# Altium project main_board.PrjPcb
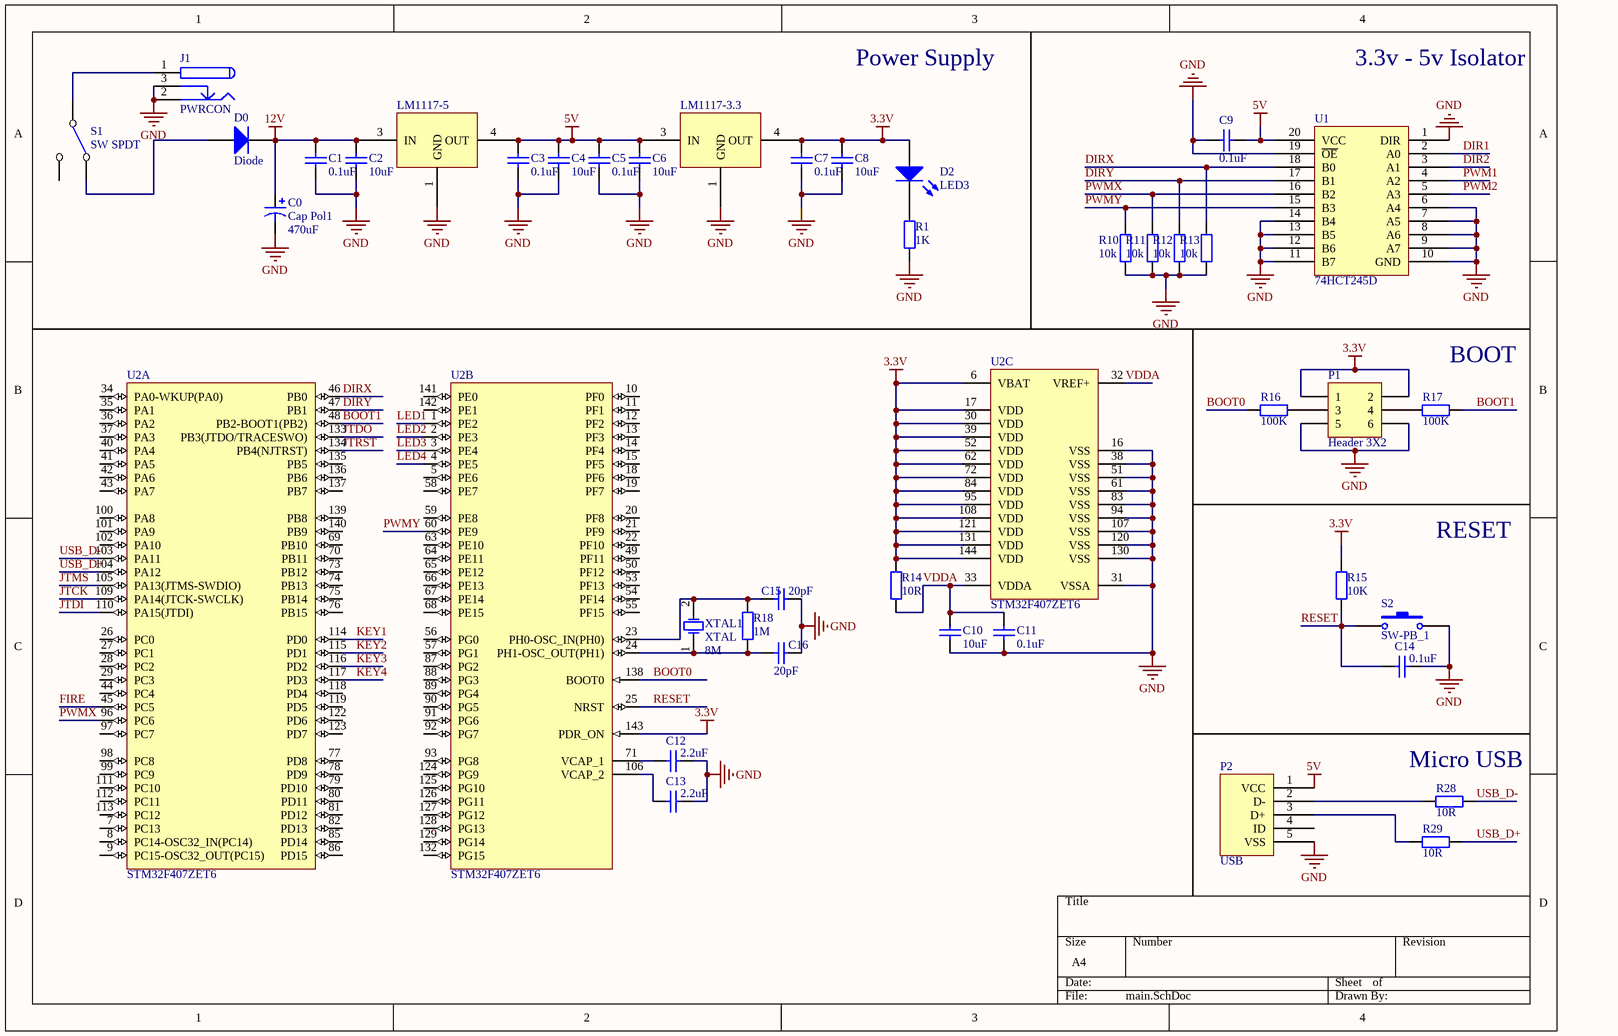
[diagram p0: main.SchDoc]
2 sheets, 61 parts. Net scope: global (net labels, ports and power ports of the same name join across sheets).
Board file: main_board.PcbDoc
Sheets:
  main.SchDoc
  other.SchDoc

## Sheet main.SchDoc
size A4

### Parts
C0  Cap Pol1  value 470uF  [CAP-10]
C1  value 0.1uF  [C-0603]  (hidden comment: Cap)
C2  value 10uF  [C-0603]  (hidden comment: Cap)
C3  value 0.1uF  [C-0603]  (hidden comment: Cap)
C4  value 10uF  [C-0603]  (hidden comment: Cap)
C5  value 0.1uF  [C-0603]  (hidden comment: Cap)
C6  value 10uF  [C-0603]  (hidden comment: Cap)
C7  value 0.1uF  [C-0603]  (hidden comment: Cap)
C8  value 10uF  [C-0603]  (hidden comment: Cap)
C9  value 0.1uF  [C-0603]  (hidden comment: Cap)
C10  value 10uF  [C-0603]  (hidden comment: Cap)
C11  value 0.1uF  [C-0603]  (hidden comment: Cap)
C12  value 2.2uF  [C-0603]  (hidden comment: Cap)
C13  value 2.2uF  [C-0603]  (hidden comment: Cap)
C14  value 0.1uF  [C-0603]  (hidden comment: Cap)
C15  value 20pF  [C-0603]  (hidden comment: Cap)
C16  value 20pF  [C-0603]  (hidden comment: Cap)
D0  Diode  [DIODE-SMA/SMB]
D2  LED3  [DIODE-1206]
J1  PWRCON  [DC-005A]
LM1117-3.3  LM1117  [lm1117]  (value not drawn)
LM1117-5  LM1117  [lm1117]  (value not drawn)
P1  Header 3X2  [HDR2X3]
P2  USB  [USB_MINI]
R1  value 1K  [R-0603]  (hidden comment: Res2)
R10  value 10k  [R-0603]  (hidden comment: Res2)
R11  value 10k  [R-0603]  (hidden comment: Res2)
R12  value 10k  [R-0603]  (hidden comment: Res2)
R13  value 10k  [R-0603]  (hidden comment: Res2)
R14  value 10R  [R-0603]  (hidden comment: Res2)
R15  value 10K  [R-0603]  (hidden comment: Res2)
R16  value 100K  [R-0603]  (hidden comment: Res2)
R17  value 100K  [R-0603]  (hidden comment: Res2)
R18  value 1M  [R-0603]  (hidden comment: Res2)
R28  value 10R  [R-0603]  (hidden comment: Res2)
R29  value 10R  [R-0603]  (hidden comment: Res2)
S1  SW SPDT  [SW3P]
S2  SW-PB_1  [SW-2-6*3]
U1  74HCT245D  [TSSOP20]
U2  STM32F407ZET6  [STM-LQFP144_M]  (parts A,B,C of 3)
XTAL1  XTAL  Frequence: 8M  [XTAL-QC49/SMD]

### Nets
3.3V: C7.2 C8.2 D2.1(A) LM1117-3.3.4(OUT) P1.1 P1.2 R14.2 R15.2 U2.6(VBAT) U2.17(VDD) U2.30(VDD) U2.39(VDD) U2.52(VDD) U2.62(VDD) U2.72(VDD) U2.84(VDD) U2.95(VDD) U2.108(VDD) U2.121(VDD) U2.131(VDD) U2.143(PDR_ON) U2.144(VDD)
5V: C3.2 C4.2 C5.2 C6.2 C9.1 LM1117-3.3.3(IN) LM1117-5.4(OUT) P2.1(VCC) U1.20(VCC)
12V: C0.1 C1.2 C2.2 D0.2(K) LM1117-5.3(IN)
GND: C0.2 C1.1 C2.1 C3.1 C4.1 C5.1 C6.1 C7.1 C8.1 C9.2 C10.1 C11.1 C12.1 C13.1 C14.1 C15.2 C16.2 J1.2 J1.3 LM1117-3.3.1(GND) LM1117-5.1(GND) P1.5 P1.6 P2.5(VSS) R1.1 R10.2 R11.2 R12.2 R13.2 S2.2 U1.1(DIR) U1.6(A4) U1.7(A5) U1.8(A6) U1.9(A7) U1.10(GND) U1.11(B7) U1.12(B6) U1.13(B5) U1.14(B4) U1.19(~{OE}) U2.16(VSS) U2.31(VSSA) U2.38(VSS) U2.51(VSS) U2.61(VSS) U2.83(VSS) U2.94(VSS) U2.107(VSS) U2.120(VSS) U2.130(VSS)
BOOT0: R16.2 U2.138(BOOT0)
BOOT1: R17.1 U2.48(PB2-BOOT1(PB2))
DIR1: U1.2(A0)
DIR2: U1.3(A1)
DIRX: R13.1 U1.18(B0) U2.46(PB0)
DIRY: R12.1 U1.17(B1) U2.47(PB1)
FIRE: U2.45(PC5)
JTCK: U2.109(PA14(JTCK-SWCLK))
JTDI: U2.110(PA15(JTDI))
JTDO: U2.133(PB3(JTDO/TRACESWO))
JTMS: U2.105(PA13(JTMS-SWDIO))
JTRST: U2.134(PB4(NJTRST))
KEY1: U2.114(PD0)
KEY2: U2.115(PD1)
KEY3: U2.116(PD2)
KEY4: U2.117(PD3)
LED1: U2.1(PE2)
LED2: U2.2(PE3)
LED3: U2.3(PE4)
LED4: U2.4(PE5)
PWM1: U1.4(A2)
PWM2: U1.5(A3)
PWMX: R11.1 U1.16(B2) U2.96(PC6)
PWMY: R10.1 U1.15(B3) U2.60(PE9)
RESET: C14.2 R15.1 S2.1 U2.25(NRST)
USB_D+: R29.1 U2.104(PA12)
USB_D-: R28.1 U2.103(PA11)
VDDA: C10.2 C11.2 R14.1 U2.32(VREF+) U2.33(VDDA)
NetC12_2: C12.2 U2.71(VCAP_1)
NetC13_2: C13.2 U2.106(VCAP_2)
NetC15_1: C15.1 R18.2 U2.23(PH0-OSC_IN(PH0)) XTAL1.2
NetC16_1: C16.1 R18.1 U2.24(PH1-OSC_OUT(PH1)) XTAL1.1
NetD0_1: D0.1(A) S1.2(NC)
NetD2_2: D2.2(K) R1.2
NetJ1_1: J1.1 S1.1(COMMON)
NetP1_3: P1.3 R16.1
NetP1_4: P1.4 R17.2
NetP2_2: P2.2(D-) R28.2
NetP2_3: P2.3(D+) R29.2

Not connected (* = marked no-connect by the designer): P2 4(ID); S1 3(NO); U2 5(PE6) 7(PC13) 8(PC14-OSC32_IN(PC14)) 9(PC15-OSC32_OUT(PC15)) 10(PF0) 11(PF1) 12(PF2) 13(PF3) 14(PF4) 15(PF5) 18(PF6) 19(PF7) 20(PF8) 21(PF9) 22(PF10) 26(PC0) 27(PC1) 28(PC2) 29(PC3) 34(PA0-WKUP(PA0)) 35(PA1) 36(PA2) 37(PA3) 40(PA4) 41(PA5) 42(PA6) 43(PA7) 44(PC4) 49(PF11) 50(PF12) 53(PF13) 54(PF14) 55(PF15) 56(PG0) 57(PG1) 58(PE7) 59(PE8) 63(PE10) 64(PE11) 65(PE12) 66(PE13) 67(PE14) 68(PE15) 69(PB10) 70(PB11) 73(PB12) 74(PB13) 75(PB14) 76(PB15) 77(PD8) 78(PD9) 79(PD10) 80(PD11) 81(PD12) 82(PD13) 85(PD14) 86(PD15) 87(PG2) 88(PG3) 89(PG4) 90(PG5) 91(PG6) 92(PG7) 93(PG8) 97(PC7) 98(PC8) 99(PC9) 100(PA8) 101(PA9) 102(PA10) 111(PC10) 112(PC11) 113(PC12) 118(PD4) 119(PD5) 122(PD6) 123(PD7) 124(PG9) 125(PG10) 126(PG11) 127(PG12) 128(PG13) 129(PG14) 132(PG15) 135(PB5) 136(PB6) 137(PB7) 139(PB8) 140(PB9) 141(PE0) 142(PE1)

### Notes on the sheet
- Power Supply
- 3.3v - 5v Isolator
- (near R17) BOOT
- RESET
- (near R28) Micro USB

### Library data of the parts
C0 = Cap Pol1: Polarized Capacitor (Radial); Published: 8-Jun-2000; LatestRevisionDate: 17-Jul-2002; LatestRevisionNote: Re-released for DXP Platform.; PackageReference: RB7.6-15; Publisher: Altium Limited; PackageDescription: Polarized Capacitor (Radial); 2 Leads
C1-C16 = Cap Semi: Capacitor (Semiconductor SIM Model); Published: 8-Jun-2000; LatestRevisionDate: 29-May-2009; LatestRevisionNote: IPC-7351 Footprint Added.; PackageReference: C1206; Publisher: Altium Limited; PackageDescription: Chip Capacitor
D0 = Diode: Default Diode; Published: 8-Jun-2000; LatestRevisionDate: 17-Jul-2002; LatestRevisionNote: Re-released for DXP Platform.; PackageVersion: Sep-1996; PackageReference: SMC; Publisher: Altium Limited; PackageDescription: DO-214-AB/SMC; 2 C-Bend Leads; Body 7.9 x 5.9 mm, inc. leads (LxW); Code_JEDEC: DO-214-AB
D2 = LED3: Typical BLUE SiC LED; Published: 8-Jun-2000; LatestRevisionDate: 17-Dec-2003; LatestRevisionNote: PCB Footprint replaced.; DatasheetVersion: 16-Apr-2002; PackageVersion: 16-Apr-2002; PackageReference: 3.5X2.8X1.9; Publisher: Altium Limited
J1 = PWRCON: 直流电源端子; Published: 17-Dec-2003; DatasheetDocument: 09-May-2002; Publisher: Altium Limited; ComponentLink1Description: Manufacturer Link; ComponentLink1URL: http://domino.kycon.com/internet/Products.html
P1 = Header 3X2: Header, 3-Pin, Dual row; LatestRevisionDate: 17-Jul-2002; LatestRevisionNote: Re-released for DXP Platform.; Publisher: Altium Limited
R1 R10-R18 R28 R29 = Res2: Resistor; Published: 8-Jun-2000; LatestRevisionDate: 17-Jul-2002; LatestRevisionNote: Re-released for DXP Platform.; PackageReference: AXIAL-0.4; Publisher: Altium Limited; PackageDescription: Axial Device, Thru-Hole; 2 Leads; 0.4 in Pin Spacing
S2 = SW-PB_1: Switch; Published: 24-Mar-1999; LatestRevisionDate: 17-Jul-2002; LatestRevisionNote: Re-released for DXP Platform.; PackageReference: SPST-2; Publisher: Altium Limited
U1 = 74lvc245
U2 = STM32F407ZET6: ARM Cortex-M4 32-bit MCU+FPU, 210 DMIPS, 512 kB Flash, 192 kB Internal RAM, 114 I/Os, 144-pin LQFP, -40 to 85 degC, Tray; Manufacturer: STMicroelectronics; D/A Converter: 2x12-bit; FLASH Size (Prog) (kB): 512; I/Os (High Current): 114; Internal RAM Size (kB): 192; Operating Frequency(F) (Processor speed) (MHz): 168; Supply Voltage(Vcc) max (V): 3.6; Supply Voltage(Vcc) min (V): 1.8; DatasheetVersion: Rev. 4; PackageVersion: Rev. 4, 06/2013; PackageReference: LQFP144; PackageDescription: 144-Pin Low Profile Quad Flat Package, 20 x 20 mm Body, 0.5 mm Pitch; Supplier 1: Digi-Key; Supplier Part Number 1: 497-11903-ND; Supplier 2: Farnell; Supplier Part Number 2: 2215229; Supplier 3: Newark; Supplier Part Number 3: 46W2203; Supplier 4: Newark; Supplier Part Number 4: 87T3795; Supplier 5: Mouser; Supplier Part Number 5: 511-STM32F407ZET6; Core: ARM Cortex-M4; Packing: Tray; Mounting Technology: Surface Mount; PartNumber: STM32F407ZET6; ComponentLink1Description: Manufacturer URL; ComponentLink1URL: http://www.st.com/web/en/home.html; ComponentLink2Description: Datasheet; ComponentLink2URL: http://www.st.com/st-web-ui/static/active/en/resource/technical/document/datasheet/DM00037051.pdf; ComponentLink3Description: Package Specification; ComponentLink3URL: http://www.st.com/st-web-ui/static/active/en/resource/technical/document/datasheet/DM00037051.pdf

## Sheet other.SchDoc
size A4
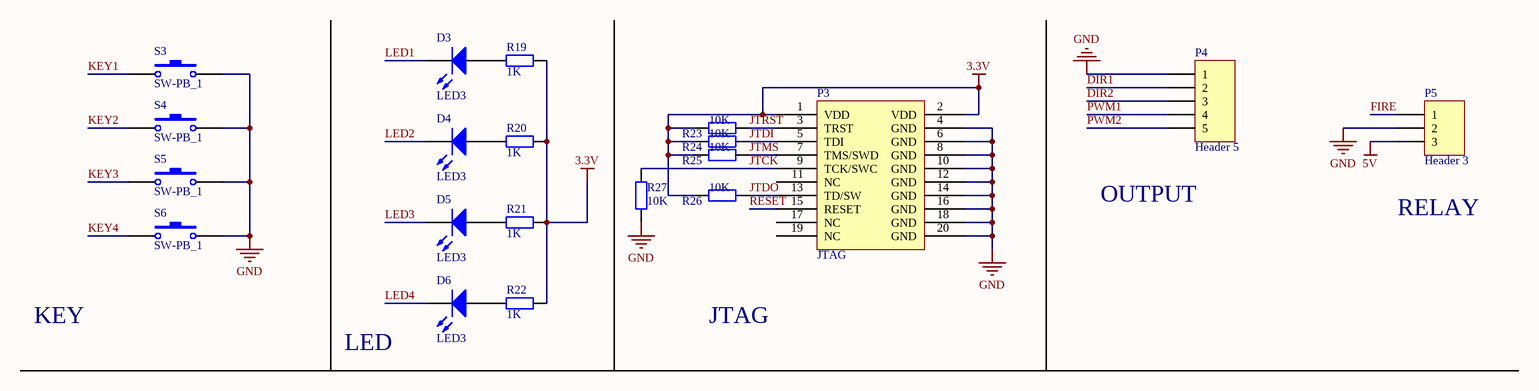
[diagram p1: other.SchDoc]

### Parts
D3  LED3  [0603-1]
D4  LED3  [0603-1]
D5  LED3  [0603-1]
D6  LED3  [0603-1]
P3  JTAG  [JTAG]
P4  Header 5  [HDR1X5]
P5  Header 3  [HDR1X3]
R19  value 1K  [R-0603]  (hidden comment: Res2)
R20  value 1K  [R-0603]  (hidden comment: Res2)
R21  value 1K  [R-0603]  (hidden comment: Res2)
R22  value 1K  [R-0603]  (hidden comment: Res2)
R23  value 10K  [R-0603]  (hidden comment: Res2)
R24  value 10K  [R-0603]  (hidden comment: Res2)
R25  value 10K  [R-0603]  (hidden comment: Res2)
R26  value 10K  [R-0603]  (hidden comment: Res2)
R27  value 10K  [R-0603]  (hidden comment: Res2)
S3  SW-PB_1  [SW-2-6*3]
S4  SW-PB_1  [SW-2-6*3]
S5  SW-PB_1  [SW-2-6*3]
S6  SW-PB_1  [SW-2-6*3]

### Nets
3.3V: P3.1(VDD) P3.2(VDD) R19.1 R20.1 R21.1 R22.1 R23.2 R24.2 R25.2 R26.2
5V: P5.3
GND: P3.4(GND) P3.6(GND) P3.8(GND) P3.10(GND) P3.12(GND) P3.14(GND) P3.16(GND) P3.18(GND) P3.20(GND) P4.1 P5.2 R27.2 S3.2 S4.2 S5.2 S6.2
DIR1: P4.2
DIR2: P4.3
FIRE: P5.1
JTCK: P3.9(TCK/SWC) R27.1
JTDI: P3.5(TDI) R24.1
JTDO: P3.13(TD/SW) R26.1
JTMS: P3.7(TMS/SWD) R25.1
JTRST: P3.3(TRST) R23.1
KEY1: S3.1
KEY2: S4.1
KEY3: S5.1
KEY4: S6.1
LED1: D3.2(K)
LED2: D4.2(K)
LED3: D5.2(K)
LED4: D6.2(K)
PWM1: P4.4
PWM2: P4.5
RESET: P3.15(RESET)
NetD3_1: D3.1(A) R19.2
NetD4_1: D4.1(A) R20.2
NetD5_1: D5.1(A) R21.2
NetD6_1: D6.1(A) R22.2

Not connected (* = marked no-connect by the designer): P3 11(NC) 17(NC) 19(NC)

### Notes on the sheet
- OUTPUT
- RELAY
- KEY
- LED
- JTAG

### Library data of the parts
D3-D6 = LED3: Typical BLUE SiC LED; Published: 8-Jun-2000; LatestRevisionDate: 17-Dec-2003; LatestRevisionNote: PCB Footprint replaced.; DatasheetVersion: 16-Apr-2002; PackageVersion: 16-Apr-2002; PackageReference: 3.5X2.8X1.9; Publisher: Altium Limited
P4 = Header 5: Header, 5-Pin; LatestRevisionDate: 17-Jul-2002; LatestRevisionNote: Re-released for DXP Platform.; Publisher: Altium Limited
P5 = Header 3: Header, 3-Pin; LatestRevisionDate: 17-Jul-2002; LatestRevisionNote: Re-released for DXP Platform.; Publisher: Altium Limited
R19-R27 = Res2: Resistor; Published: 8-Jun-2000; LatestRevisionDate: 17-Jul-2002; LatestRevisionNote: Re-released for DXP Platform.; PackageReference: AXIAL-0.4; Publisher: Altium Limited; PackageDescription: Axial Device, Thru-Hole; 2 Leads; 0.4 in Pin Spacing
S3-S6 = SW-PB_1: Switch; Published: 24-Mar-1999; LatestRevisionDate: 17-Jul-2002; LatestRevisionNote: Re-released for DXP Platform.; PackageReference: SPST-2; Publisher: Altium Limited

## Nets that join several sheets
3.3V: main (22 pins), other (10 pins)
5V: main (9 pins), other (P5.3)
GND: main (51 pins), other (16 pins)
DIR1: main (U1.2), other (P4.2)
DIR2: main (U1.3), other (P4.3)
FIRE: main (U2.45), other (P5.1)
JTCK: main (U2.109), other (P3.9 R27.1)
JTDI: main (U2.110), other (P3.5 R24.1)
JTDO: main (U2.133), other (P3.13 R26.1)
JTMS: main (U2.105), other (P3.7 R25.1)
JTRST: main (U2.134), other (P3.3 R23.1)
KEY1: main (U2.114), other (S3.1)
KEY2: main (U2.115), other (S4.1)
KEY3: main (U2.116), other (S5.1)
KEY4: main (U2.117), other (S6.1)
LED1: main (U2.1), other (D3.2)
LED2: main (U2.2), other (D4.2)
LED3: main (U2.3), other (D5.2)
LED4: main (U2.4), other (D6.2)
PWM1: main (U1.4), other (P4.4)
PWM2: main (U1.5), other (P4.5)
RESET: main (C14.2 R15.1 S2.1 U2.25), other (P3.15)